# Altium schematic sheet v0.SchDoc
size C
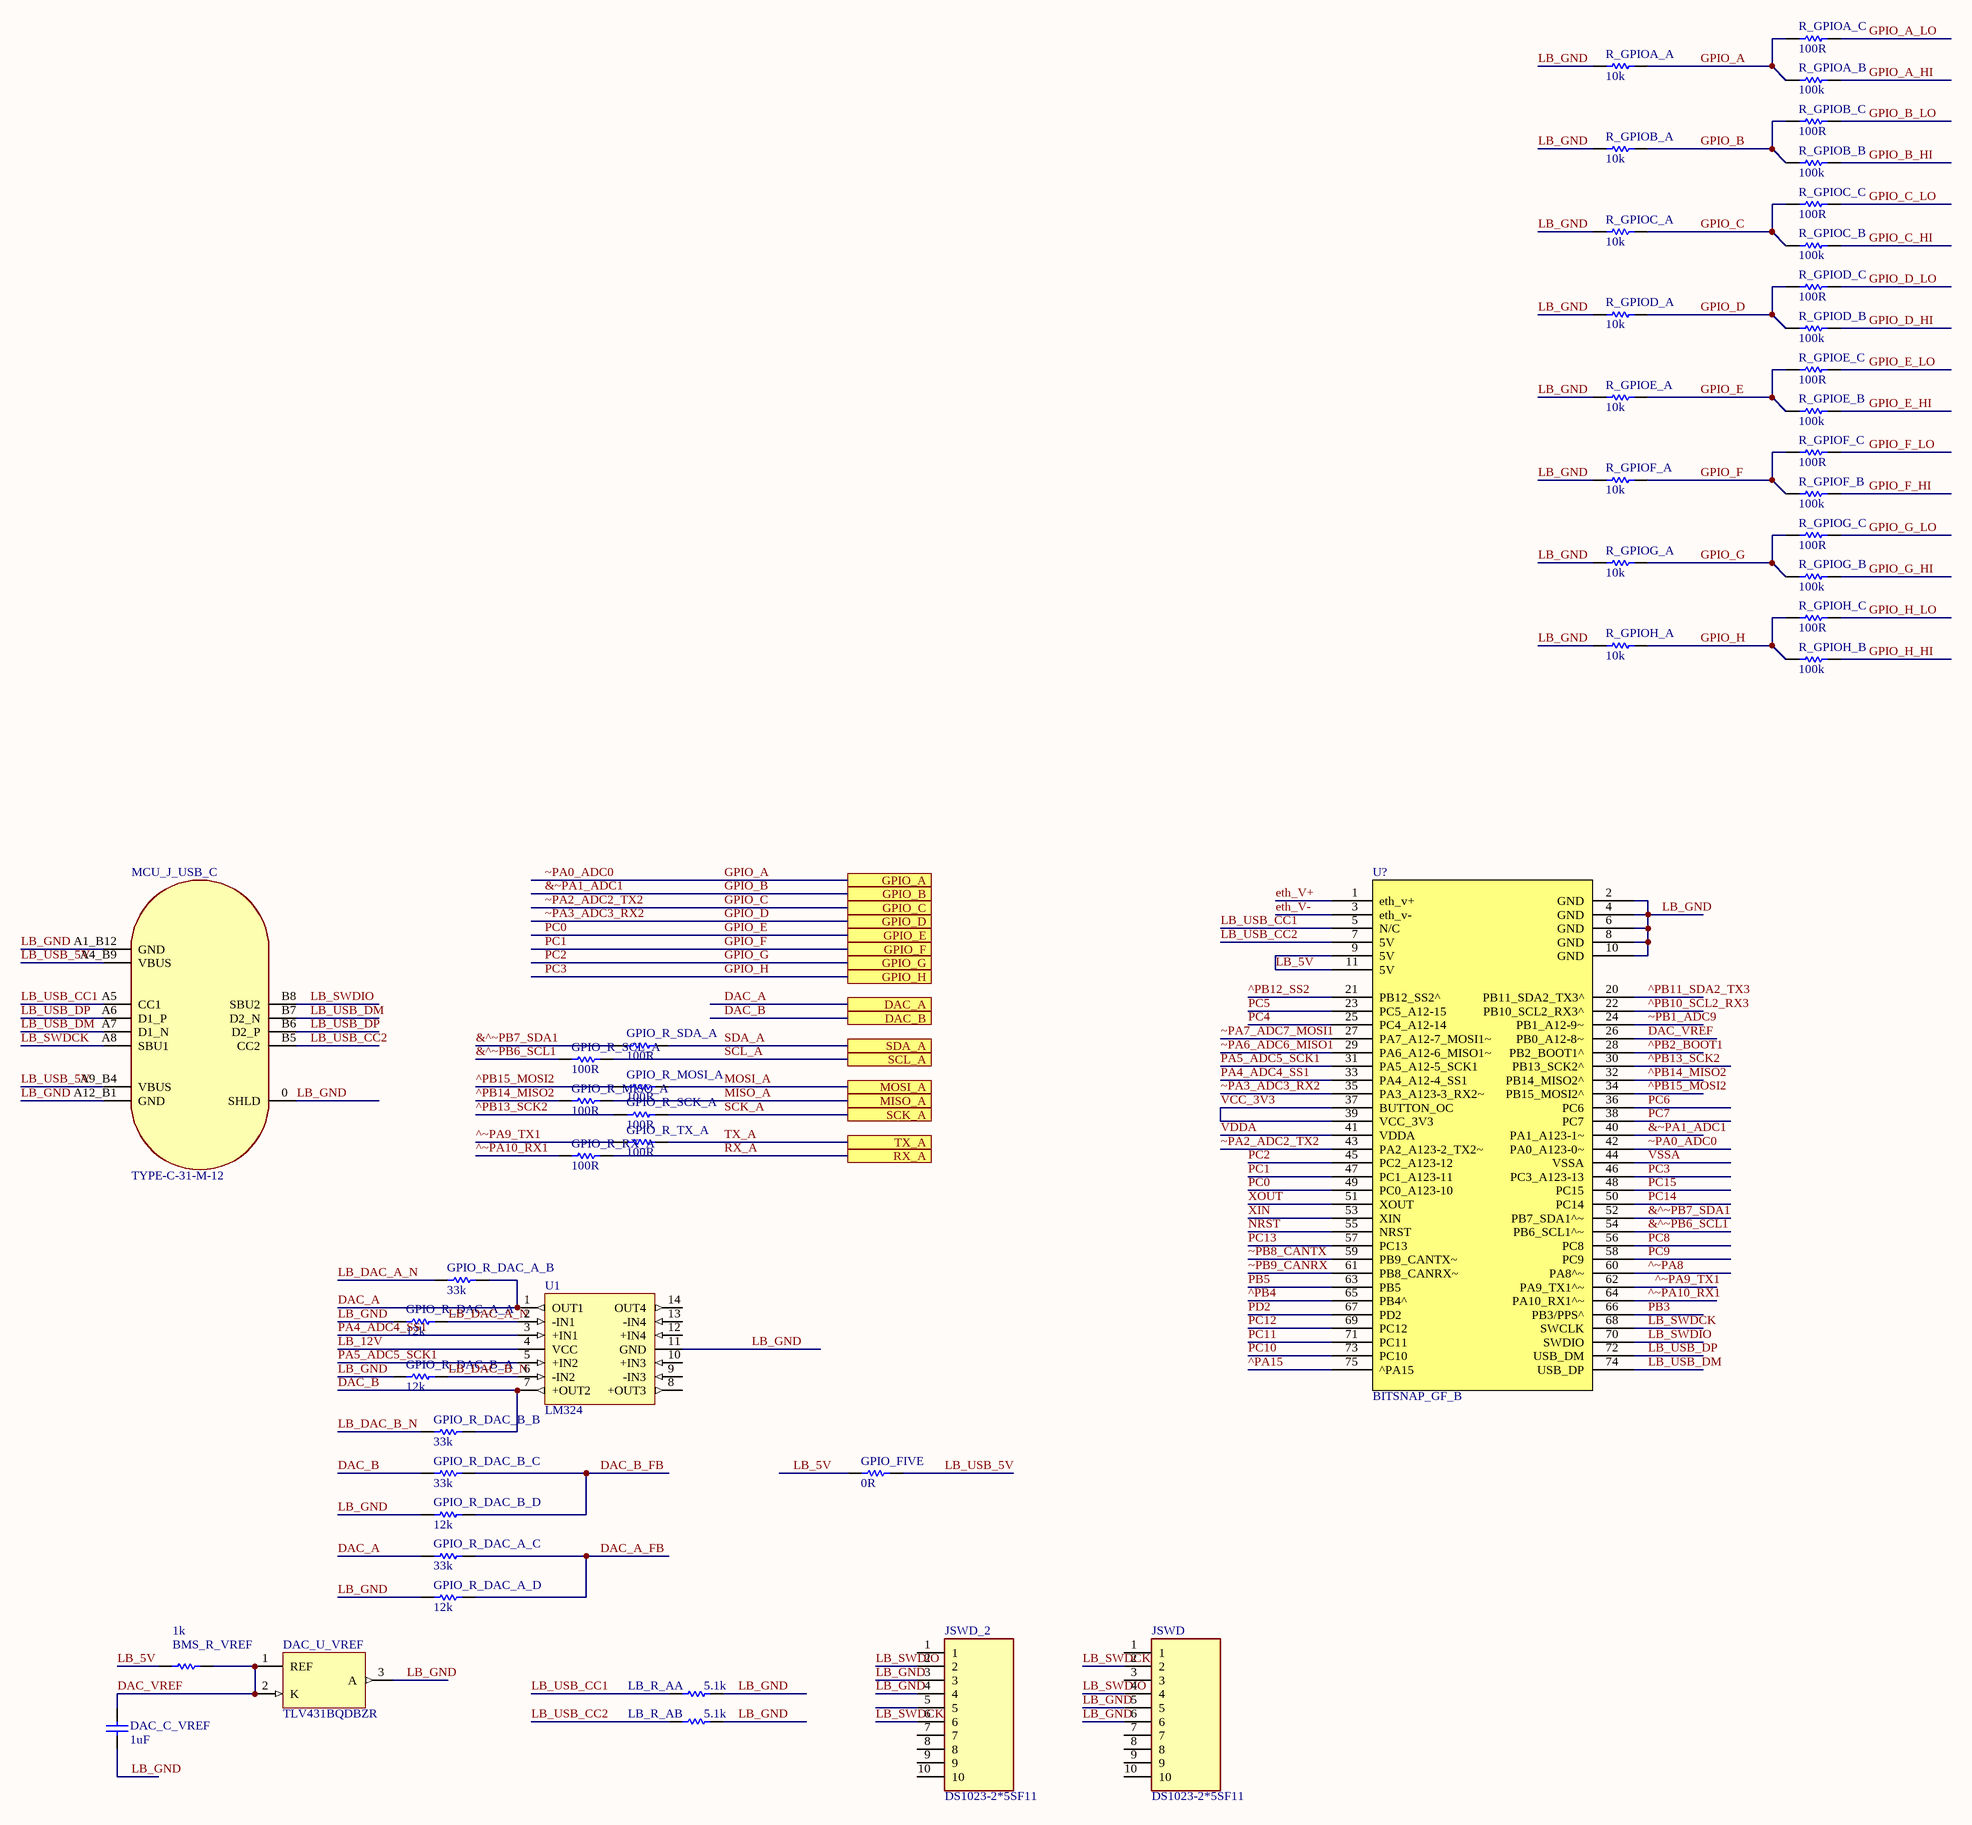
[diagram p0: v0.SchDoc]

## Parts
BMS_R_VREF  value 1k  [R_0402]  (hidden comment: 0402WGF1001TCE)
DAC_C_VREF  value 1uF  [C_0402]  (hidden comment: CL05A105KA5NQNC)
DAC_U_VREF  TLV431BQDBZR  [TO-236AB]
GPIO_FIVE  value 0R  [R_0402]  (hidden comment: 0402WGF0000TCE)
GPIO_R_DAC_A_A  value 12k  [R_0402]  (hidden comment: 0402WGF1202TCE)
GPIO_R_DAC_A_B  value 33k  [R_0402]  (hidden comment: 0402WGF3302TCE)
GPIO_R_DAC_A_C  value 33k  [R_0402]  (hidden comment: 0402WGF3302TCE)
GPIO_R_DAC_A_D  value 12k  [R_0402]  (hidden comment: 0402WGF1202TCE)
GPIO_R_DAC_B_A  value 12k  [R_0402]  (hidden comment: 0402WGF1202TCE)
GPIO_R_DAC_B_B  value 33k  [R_0402]  (hidden comment: 0402WGF3302TCE)
GPIO_R_DAC_B_C  value 33k  [R_0402]  (hidden comment: 0402WGF3302TCE)
GPIO_R_DAC_B_D  value 12k  [R_0402]  (hidden comment: 0402WGF1202TCE)
GPIO_R_MISO_A  value 100R  [R_0402]  (hidden comment: 0402WGF1000TCE)
GPIO_R_MOSI_A  value 100R  [R_0402]  (hidden comment: 0402WGF1000TCE)
GPIO_R_RX_A  value 100R  [R_0402]  (hidden comment: 0402WGF1000TCE)
GPIO_R_SCK_A  value 100R  [R_0402]  (hidden comment: 0402WGF1000TCE)
GPIO_R_SCL_A  value 100R  [R_0402]  (hidden comment: 0402WGF1000TCE)
GPIO_R_SDA_A  value 100R  [R_0402]  (hidden comment: 0402WGF1000TCE)
GPIO_R_TX_A  value 100R  [R_0402]  (hidden comment: 0402WGF1000TCE)
JSWD  DS1023-2*5SF11  [HDR_FEM_2X5P]
JSWD_2  DS1023-2*5SF11  [HDR_FEM_2X5P]
LB_R_AA  value 5.1k  [R_0402]  (hidden comment: 0402WGF5101TCE)
LB_R_AB  value 5.1k  [R_0402]  (hidden comment: 0402WGF5101TCE)
MCU_J_USB_C  TYPE-C-31-M-12  [TYPE-C-31-M-12]
R_GPIOA_A  value 10k  [R_0402]  (hidden comment: 0402WGF1002TCE)
R_GPIOA_B  value 100k  [R_0402]  (hidden comment: 0402WGF1003TCE)
R_GPIOA_C  value 100R  [R_0402]  (hidden comment: 0402WGF1000TCE)
R_GPIOB_A  value 10k  [R_0402]  (hidden comment: 0402WGF1002TCE)
R_GPIOB_B  value 100k  [R_0402]  (hidden comment: 0402WGF1003TCE)
R_GPIOB_C  value 100R  [R_0402]  (hidden comment: 0402WGF1000TCE)
R_GPIOC_A  value 10k  [R_0402]  (hidden comment: 0402WGF1002TCE)
R_GPIOC_B  value 100k  [R_0402]  (hidden comment: 0402WGF1003TCE)
R_GPIOC_C  value 100R  [R_0402]  (hidden comment: 0402WGF1000TCE)
R_GPIOD_A  value 10k  [R_0402]  (hidden comment: 0402WGF1002TCE)
R_GPIOD_B  value 100k  [R_0402]  (hidden comment: 0402WGF1003TCE)
R_GPIOD_C  value 100R  [R_0402]  (hidden comment: 0402WGF1000TCE)
R_GPIOE_A  value 10k  [R_0402]  (hidden comment: 0402WGF1002TCE)
R_GPIOE_B  value 100k  [R_0402]  (hidden comment: 0402WGF1003TCE)
R_GPIOE_C  value 100R  [R_0402]  (hidden comment: 0402WGF1000TCE)
R_GPIOF_A  value 10k  [R_0402]  (hidden comment: 0402WGF1002TCE)
R_GPIOF_B  value 100k  [R_0402]  (hidden comment: 0402WGF1003TCE)
R_GPIOF_C  value 100R  [R_0402]  (hidden comment: 0402WGF1000TCE)
R_GPIOG_A  value 10k  [R_0402]  (hidden comment: 0402WGF1002TCE)
R_GPIOG_B  value 100k  [R_0402]  (hidden comment: 0402WGF1003TCE)
R_GPIOG_C  value 100R  [R_0402]  (hidden comment: 0402WGF1000TCE)
R_GPIOH_A  value 10k  [R_0402]  (hidden comment: 0402WGF1002TCE)
R_GPIOH_B  value 100k  [R_0402]  (hidden comment: 0402WGF1003TCE)
R_GPIOH_C  value 100R  [R_0402]  (hidden comment: 0402WGF1000TCE)
U1  LM324  [SOIC-14-P1.27-W3.5]
U?  BITSNAP_GF_B  [POWERNET-MAC]

## Ports
DAC_A, DAC_B, GPIO_A, GPIO_B, GPIO_C, GPIO_D, GPIO_E, GPIO_F, GPIO_G, GPIO_H, MISO_A, MOSI_A, RX_A, SCK_A, SCL_A, SDA_A, TX_A

## Nets
&^~PB6_SCL1: GPIO_R_SCL_A.1 U?.54(PB6_SCL1^~)
&^~PB7_SDA1: GPIO_R_SDA_A.1 U?.52(PB7_SDA1^~)
&~PA1_ADC1: R_GPIOB_A.2 R_GPIOB_B.1 R_GPIOB_C.1 U?.40(PA1_A123-1~) ; port GPIO_B  [also labelled GPIO_B]
^PA15: U?.75(^PA15)
^PB2_BOOT1: U?.28(PB2_BOOT1^)
^PB4: U?.65(PB4^)
^PB10_SCL2_RX3: U?.22(PB10_SCL2_RX3^)
^PB11_SDA2_TX3: U?.20(PB11_SDA2_TX3^)
^PB12_SS2: U?.21(PB12_SS2^)
^PB13_SCK2: GPIO_R_SCK_A.1 U?.30(PB13_SCK2^)
^PB14_MISO2: GPIO_R_MISO_A.1 U?.32(PB14_MISO2^)
^PB15_MOSI2: GPIO_R_MOSI_A.1 U?.34(PB15_MOSI2^)
^~PA8: U?.60(PA8^~)
^~PA9_TX1: GPIO_R_TX_A.1 U?.62(PA9_TX1^~)
^~PA10_RX1: GPIO_R_RX_A.1 U?.64(PA10_RX1^~)
DAC_A: GPIO_R_DAC_A_B.2 GPIO_R_DAC_A_C.1 U1.1(OUT1) ; port DAC_A
DAC_A_FB: GPIO_R_DAC_A_C.2 GPIO_R_DAC_A_D.2
DAC_B: GPIO_R_DAC_B_B.2 GPIO_R_DAC_B_C.1 U1.7(+OUT2) ; port DAC_B
DAC_B_FB: GPIO_R_DAC_B_C.2 GPIO_R_DAC_B_D.2
DAC_VREF: BMS_R_VREF.2 DAC_C_VREF.2 DAC_U_VREF.1(REF) DAC_U_VREF.2(K) U?.26(PB0_A12-8~)
eth_V+: U?.1(eth_v+)
eth_V-: U?.3(eth_v-)
GPIO_A: R_GPIOA_A.2 R_GPIOA_B.1 R_GPIOA_C.1 U?.42(PA0_A123-0~) ; port GPIO_A  [also labelled ~PA0_ADC0]
GPIO_A_HI: R_GPIOA_B.2
GPIO_A_LO: R_GPIOA_C.2
GPIO_B_HI: R_GPIOB_B.2
GPIO_B_LO: R_GPIOB_C.2
GPIO_C: R_GPIOC_A.2 R_GPIOC_B.1 R_GPIOC_C.1 U?.43(PA2_A123-2_TX2~) ; port GPIO_C  [also labelled ~PA2_ADC2_TX2]
GPIO_C_HI: R_GPIOC_B.2
GPIO_C_LO: R_GPIOC_C.2
GPIO_D: R_GPIOD_A.2 R_GPIOD_B.1 R_GPIOD_C.1 U?.35(PA3_A123-3_RX2~) ; port GPIO_D  [also labelled ~PA3_ADC3_RX2]
GPIO_D_HI: R_GPIOD_B.2
GPIO_D_LO: R_GPIOD_C.2
GPIO_E: R_GPIOE_A.2 R_GPIOE_B.1 R_GPIOE_C.1 U?.49(PC0_A123-10) ; port GPIO_E  [also labelled PC0]
GPIO_E_HI: R_GPIOE_B.2
GPIO_E_LO: R_GPIOE_C.2
GPIO_F: R_GPIOF_A.2 R_GPIOF_B.1 R_GPIOF_C.1 U?.47(PC1_A123-11) ; port GPIO_F  [also labelled PC1]
GPIO_F_HI: R_GPIOF_B.2
GPIO_F_LO: R_GPIOF_C.2
GPIO_G: R_GPIOG_A.2 R_GPIOG_B.1 R_GPIOG_C.1 U?.45(PC2_A123-12) ; port GPIO_G  [also labelled PC2]
GPIO_G_HI: R_GPIOG_B.2
GPIO_G_LO: R_GPIOG_C.2
GPIO_H: R_GPIOH_A.2 R_GPIOH_B.1 R_GPIOH_C.1 U?.46(PC3_A123-13) ; port GPIO_H  [also labelled PC3]
GPIO_H_HI: R_GPIOH_B.2
GPIO_H_LO: R_GPIOH_C.2
LB_5V: BMS_R_VREF.1 GPIO_FIVE.1 U?.9(5V) U?.11(5V)
LB_12V: U1.4(VCC)
LB_DAC_A_N: GPIO_R_DAC_A_A.2 GPIO_R_DAC_A_B.1 U1.2(-IN1)
LB_DAC_B_N: GPIO_R_DAC_B_A.2 GPIO_R_DAC_B_B.1 U1.6(-IN2)
LB_GND: DAC_C_VREF.1 DAC_U_VREF.3(A) GPIO_R_DAC_A_A.1 GPIO_R_DAC_A_D.1 GPIO_R_DAC_B_A.1 GPIO_R_DAC_B_D.1 JSWD.5 JSWD.6 JSWD_2.3 JSWD_2.4 LB_R_AA.2 LB_R_AB.2 MCU_J_USB_C.0(SHLD) MCU_J_USB_C.A1_B12(GND) MCU_J_USB_C.A12_B1(GND) R_GPIOA_A.1 R_GPIOB_A.1 R_GPIOC_A.1 R_GPIOD_A.1 R_GPIOE_A.1 R_GPIOF_A.1 R_GPIOG_A.1 R_GPIOH_A.1 U1.11(GND) U?.2(GND) U?.4(GND) U?.6(GND) U?.8(GND) U?.10(GND)
LB_SWDCK: JSWD.2 JSWD_2.6 MCU_J_USB_C.A8(SBU1) U?.68(SWCLK)
LB_SWDIO: JSWD.4 JSWD_2.2 MCU_J_USB_C.B8(SBU2) U?.70(SWDIO)
LB_USB_5V: GPIO_FIVE.2 MCU_J_USB_C.A4_B9(VBUS) MCU_J_USB_C.A9_B4(VBUS)
LB_USB_CC1: LB_R_AA.1 MCU_J_USB_C.A5(CC1) U?.5(N/C)
LB_USB_CC2: LB_R_AB.1 MCU_J_USB_C.B5(CC2) U?.7(5V)
LB_USB_DM: MCU_J_USB_C.A7(D1_N) MCU_J_USB_C.B7(D2_N) U?.74(USB_DP)
LB_USB_DP: MCU_J_USB_C.A6(D1_P) MCU_J_USB_C.B6(D2_P) U?.72(USB_DM)
MISO_A: GPIO_R_MISO_A.2 ; port MISO_A
MOSI_A: GPIO_R_MOSI_A.2 ; port MOSI_A
NRST: U?.55(NRST)
PA4_ADC4_SS1: U1.3(+IN1) U?.33(PA4_A12-4_SS1)
PA5_ADC5_SCK1: U1.5(+IN2) U?.31(PA5_A12-5_SCK1)
PB3: U?.66(PB3/PPS^)
PB5: U?.63(PB5)
PC4: U?.25(PC4_A12-14)
PC5: U?.23(PC5_A12-15)
PC6: U?.36(PC6)
PC7: U?.38(PC7)
PC8: U?.56(PC8)
PC9: U?.58(PC9)
PC10: U?.73(PC10)
PC11: U?.71(PC11)
PC12: U?.69(PC12)
PC13: U?.57(PC13)
PC14: U?.50(PC14)
PC15: U?.48(PC15)
PD2: U?.67(PD2)
RX_A: GPIO_R_RX_A.2 ; port RX_A
SCK_A: GPIO_R_SCK_A.2 ; port SCK_A
SCL_A: GPIO_R_SCL_A.2 ; port SCL_A
SDA_A: GPIO_R_SDA_A.2 ; port SDA_A
TX_A: GPIO_R_TX_A.2 ; port TX_A
VCC_3V3: U?.37(BUTTON_OC) U?.39(VCC_3V3)
VDDA: U?.41(VDDA)
VSSA: U?.44(VSSA)
XIN: U?.53(XIN)
XOUT: U?.51(XOUT)
~PA6_ADC6_MISO1: U?.29(PA6_A12-6_MISO1~)
~PA7_ADC7_MOSI1: U?.27(PA7_A12-7_MOSI1~)
~PB1_ADC9: U?.24(PB1_A12-9~)
~PB8_CANTX: U?.59(PB9_CANTX~)
~PB9_CANRX: U?.61(PB8_CANRX~)

Not connected (* = marked no-connect by the designer): JSWD 1 3 7 8 9 10; JSWD_2 1 5 7 8 9 10; U1 8(+OUT3) 9(-IN3) 10(+IN3) 12(+IN4) 13(-IN4) 14(OUT4)

## Library data of the parts
BMS_R_VREF = 0402WGF1001TCE: R - RESISTOR - SMD - 1k - 1% - 0402; LCSC Part #: C11702; JLC Availability: Basic
DAC_C_VREF = CL05A105KA5NQNC: C - CAPACITOR - MLCC - 1uF - 25V - 0402; WVDC: 16; LCSC Part #: C52923; JLC Availability: Basic
DAC_U_VREF = TLV431BQDBZR: U - IC - ADJUSTABLE SHUNT REGULATOR; VOut: ADJ; LCSC Part #: C398374; JLC Availability: Extended
GPIO_FIVE = 0402WGF0000TCE: R - RESISTOR - SMD - 0R - 1% - 0402; LCSC Part #: C17168; JLC Availability: Basic
GPIO_R_DAC_A_A GPIO_R_DAC_A_D GPIO_R_DAC_B_A GPIO_R_DAC_B_D = 0402WGF1202TCE: R - RESISTOR - SMD - 12k - 1% - 0402; LCSC Part #: C25752; JLC Availability: Basic
GPIO_R_DAC_A_B GPIO_R_DAC_A_C GPIO_R_DAC_B_B GPIO_R_DAC_B_C = 0402WGF3302TCE: R - RESISTOR - SMD - 33k - 1% - 0402; LCSC Part #: C25779; JLC Availability: Basic
GPIO_R_MISO_A GPIO_R_MOSI_A GPIO_R_RX_A GPIO_R_SCK_A GPIO_R_SCL_A GPIO_R_SDA_A GPIO_R_TX_A R_GPIOA_C R_GPIOB_C R_GPIOC_C R_GPIOD_C R_GPIOE_C R_GPIOF_C R_GPIOG_C R_GPIOH_C = 0402WGF1000TCE: R - RESISTOR - SMD - 100R - 1% - 0402; LCSC Part #: C25076; JLC Availability: Basic
JSWD JSWD_2 = DS1023-2*5SF11: J - JACK - PIN_HEADER 2X5P; LCSC Part #: C92270; JLC Availability: Extended
LB_R_AA LB_R_AB = 0402WGF5101TCE: R - RESISTOR - SMD - 5.1k - 1% - 0402; LCSC Part #: C25905; JLC Availability: Basic
MCU_J_USB_C = TYPE-C-31-M-12: J - JACK - USB - Type C - Recepticle - SMT - 90°; JLC Availability: Extended; LCSC Part #: C165948
R_GPIOA_A R_GPIOB_A R_GPIOC_A R_GPIOD_A R_GPIOE_A R_GPIOF_A R_GPIOG_A R_GPIOH_A = 0402WGF1002TCE: R - RESISTOR - SMD - 10k - 1% - 0402; LCSC Part #: C25744; JLC Availability: Basic
R_GPIOA_B R_GPIOB_B R_GPIOC_B R_GPIOD_B R_GPIOE_B R_GPIOF_B R_GPIOG_B R_GPIOH_B = 0402WGF1003TCE: R - RESISTOR - SMD - 100k - 1% -  0402; LCSC Part #: C25741; JLC Availability: Basic
U1 = LM324DT: U - IC - OP AMP (QUAD); Speed: 0.4V/us; LCSC Part #: C71035; JLC Availability: Basic
U? = POWERNET_MAC: U - IC - Bitsnap CPU, NGFF B Key; Manufacturer: Foxconn; Manufacturer P/N: AS0BC21-S30BB-7H; LCSC Part #: C2761344